# EAGLE design rapidshark-usb-breakout-mk-1.4 (EAGLE 7.5.0)
AUTHOR: sean@yak.net
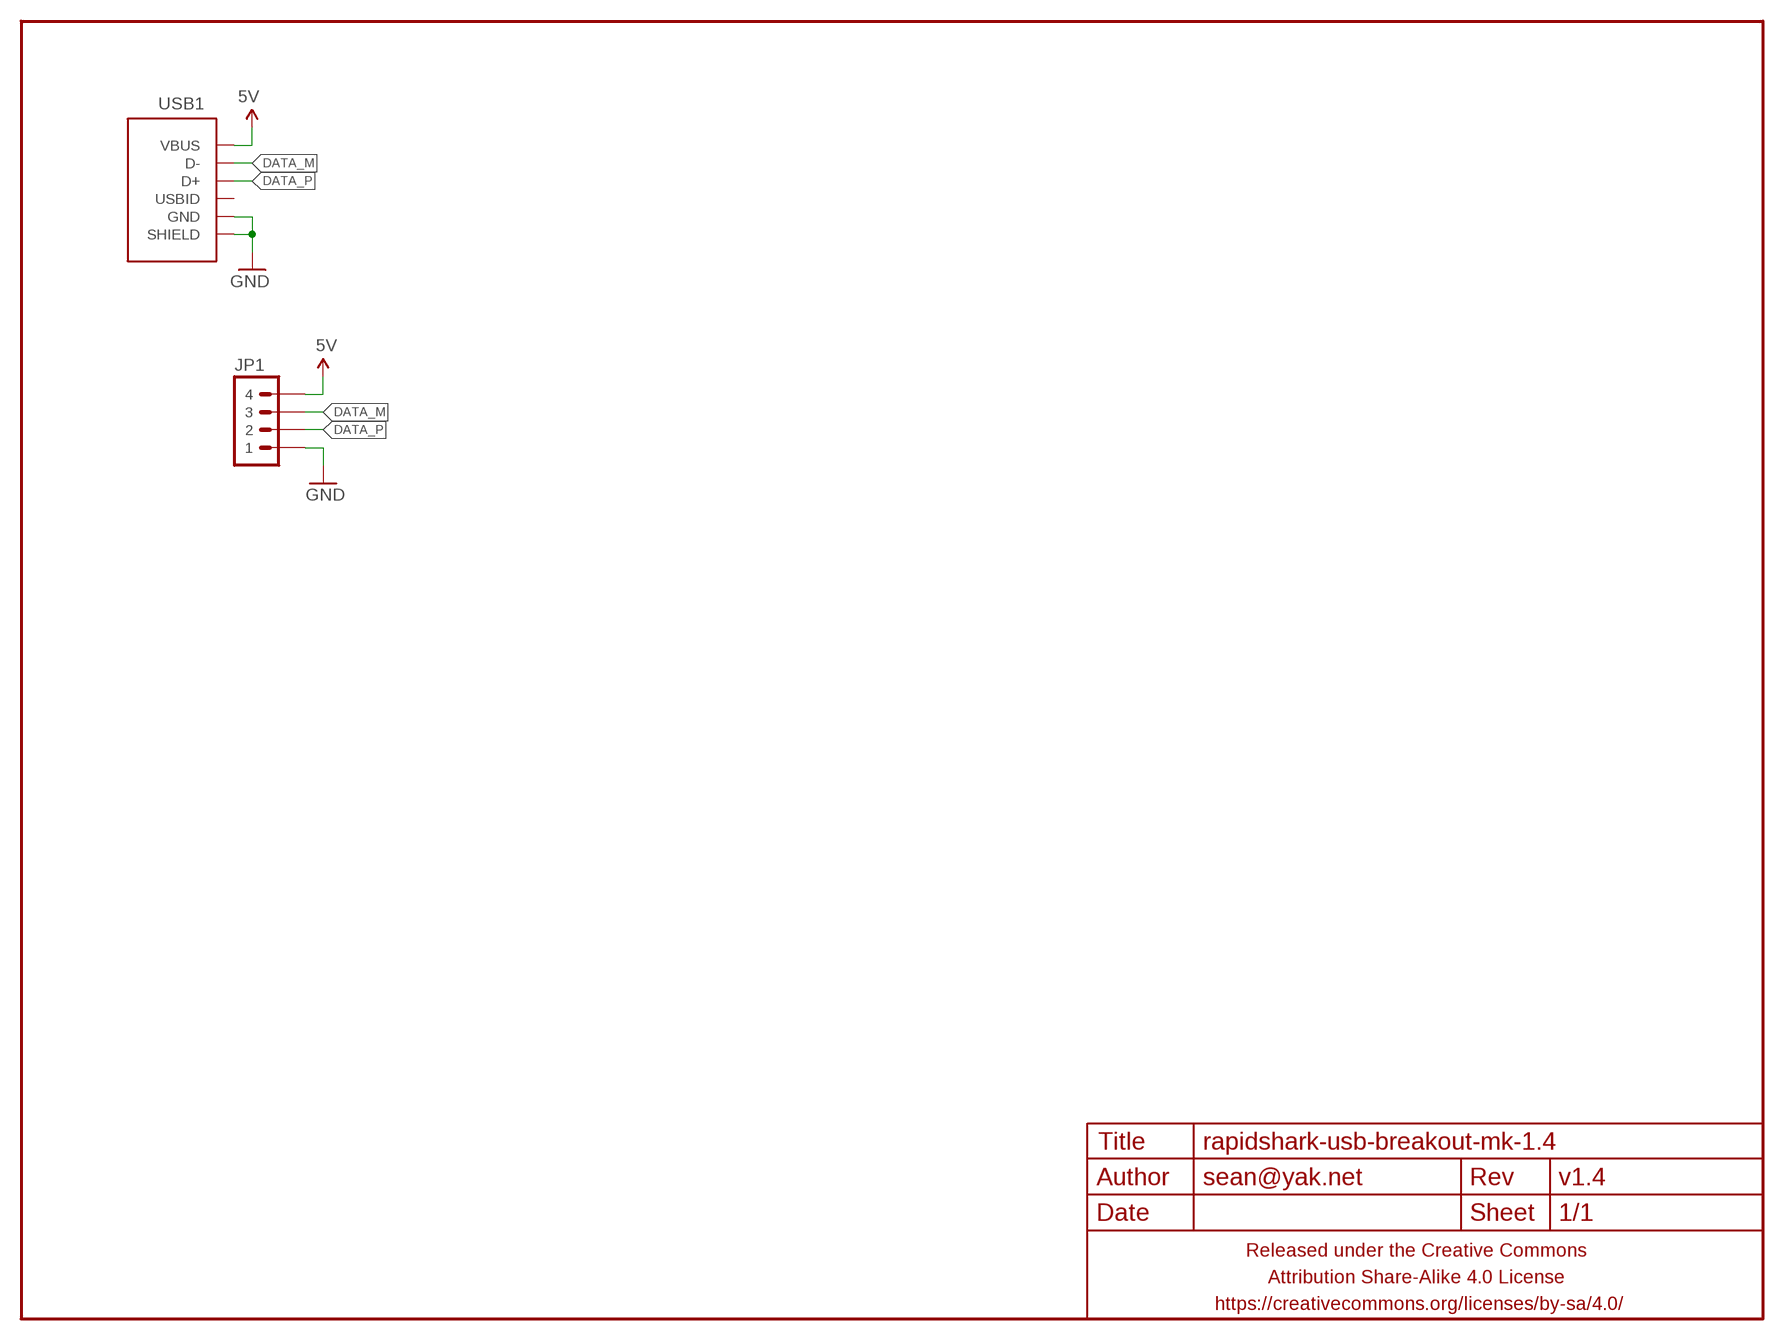
[diagram p0: schematic, sheet 1]

## Parts
FRAME1  FRAME-LETTERNO_PACKAGE  [DUMMY]
JP1  M04PTH-CENTERED  [1X04-PTH-VERT-CENTER]
USB1  USB-AB-SHIELDFCI-10118193-USB-MICRO-B  [FCI-10118193-USB-MICRO-B]

## Nets
5V: JP1.4 USB1.1(VBUS)
DATA_M: JP1.3 USB1.2(D-)
DATA_P: JP1.2 USB1.3(D+)
GND: JP1.1 USB1.5(GND) USB1.SHIELD@1(SHIELD) USB1.SHIELD@2(SHIELD) USB1.SHIELD@3(SHIELD) USB1.SHIELD@4(SHIELD)
Unconnected: USB1.4(USBID)

## Library data of the parts
FRAME1 = a_parts:FRAME-LETTER: Schematic Frame Standard 8.5x11 US Letter frame; DESIGNER: sean@yak.net; VERSION: v1.4
JP1 = a_parts:M04: Header 4 Standard 4-pin 0.1" header. Use with straight break away headers (SKU : PRT-00116), right angle break away headers (PRT-00553), swiss pins (PRT-00743), machine pins (PRT-00117), and female headers (PRT-00115). Molex polarized connector foot print use with SKU : PRT-08231 with associated crimp pins and housings. 1MM SMD Version SKU: PRT-10208
USB1 = a_parts:USB-AB-SHIELD

## Board
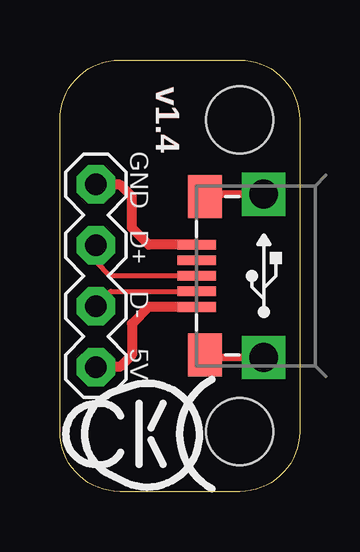
[diagram p1: board, top side]
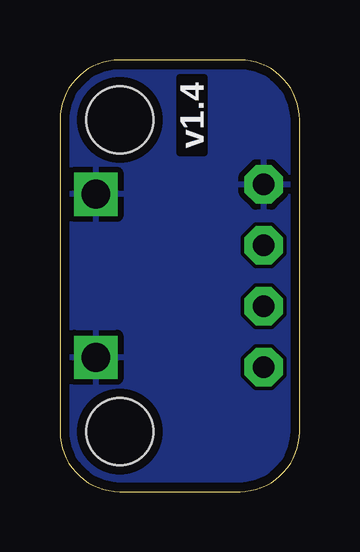
[diagram p2: board, bottom side, seen from below]

Size 10 x 18 mm. Coordinates in mm from the lower left corner, seen from the top.
Outline: 10,15.5 10,2.5 arc-90 7.5,0 2.5,0 arc-90 0,2.5 0,15.5 arc-90 2.5,18 7.5,18 arc-90 10,15.5
Copper layers (1*16): Top 0.0356mm / dielectric 1.5011mm / Bottom 0.0356mm
Design rules "LaenPCBOrder_2": minimum track width 6mil, minimum drill 13mil, track to track 6mil, track to pad 6mil, pad to pad 6mil, via to via 6mil, smd to smd 6mil, copper to edge 15mil, drill to drill 6mil, minimum pad ring 7mil, minimum via ring 7mil, stop-mask expansion 3mil, vias tented up to drill 20mil, thermal gap 10mil
Holes 2.8 mm at 7.5,2.5 7.5,15.5

### Footprints (pad centres in the part's own frame; a part is rotated, then mirrored left to right if it is on the bottom)
1X04-PTH-VERT-CENTER = drill 0.9 pad 1.6 octagon: 1 -3.81,0; 2 -1.27,0; 3 1.27,0; 4 3.81,0
FCI-10118193-USB-MICRO-B = smd 0.4 x 1.6: 1 -1.3,2.8; 2 -0.65,2.8; 3 0,2.8; 4 0.65,2.8; 5 1.3,2.8 | smd 1.8 x 1.4: SHIELD@1 -3.3,2.45; SHIELD@2 3.3,2.45 | drill 1.2 pad 1.8 square: SHIELD@3 -3.4,0; SHIELD@4 3.4,0

### Placement (x,y rotation side)
FRAME1  0,0 270 bottom
JP1  1.5,9 270 top
U$1  [COW_SMALL_NOTEXT]  3.8,2.4 270 top
USB1  8.5,9 90 top

### Tracks (layer width: path | path; a pad name or v marks a point on that pad's centre or on a via)
5V
  Top 0.406: USB1.1 3.7,7.7 3,7 3,5.7 2.5,5.2 JP1.4
DATA_M
  Top 0.203: JP1.3 2.12,8.35 USB1.2
DATA_P
  Top 0.203: USB1.3 2.1,9 1.5,9.6 JP1.2
GND
  Top 0.305: USB1.SHIELD@2 5.95,12.4 USB1.SHIELD@4 | USB1.SHIELD@1 5.95,5.6 USB1.SHIELD@3
  Top 0.406: USB1.5 3.7,10.3 3,11 3,12.3 2.5,12.8 JP1.1
  pour Bottom (rank 6): 10,15.5 10,2.5 arc-90 7.5,0 2.5,0 arc-90 0,2.5 0,15.5 arc-90 2.5,18 7.5,18 arc-90

### Text on the board
tPlace: GND | D+ | D- | 5V